# Altium project 5vto3.3v.PrjPCB
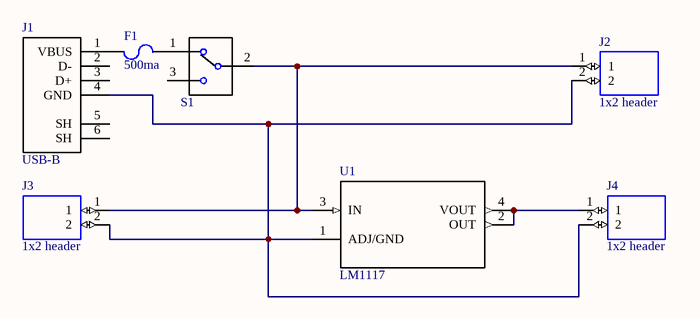
[diagram p0: 5vto3.3v.SchDoc]
1 sheet, 7 parts. Net scope: global (net labels, ports and power ports of the same name join across sheets).
Board file: 5vto3.3v.PcbDoc

## Sheet 5vto3.3v.SchDoc: 5vto3.3v
size A4; Author: Julong Xie; Organization: Altium Limited; Address1: L3, 12a Rodborough Rd; Address2: Frenchs Forest; Address3: NSW; Address4: Australia 2086; Revision: v0.1; SheetNumber: 1; SheetTotal: 1

### Parts
F1  500ma  [Fuse 0603]
J1  USB-B  [SAMTEC_USB-B-S-S-B-VT-R]
J2  1x2 header  [B2B-XH-A(LF)(SN)]
J3  1x2 header  [B2B-XH-A(LF)(SN)]
J4  1x2 header  [B2B-XH-A(LF)(SN)]
S1  TOGGLE SWITCH  [A101SYCQ04]  (value not drawn)
U1  LM1117  [LM1117MP-3.3]

### Nets
NetF1_1: F1.1 S1.1
NetJ1_4: J1.4(GND) J2.2 J3.2 J4.2 U1.1(ADJ/GND)
NetJ2_1: J2.1 J3.1 S1.2 U1.3(IN)
NetJ4_1: J4.1 U1.2(OUT) U1.4(VOUT)

Not connected (* = marked no-connect by the designer): F1 2; J1 1(VBUS) 2(D-) 3(D+) 5(SH) 6(SH); S1 3

### Notes on the sheet
- Title
- Size:
- Date:
- A4
- Number:
- Time:
- Revision:
- Sheet
- of
- Author:
- File:

### Library data of the parts
F1 = 0494.500NRHF: FUSE BOARD MOUNT 500MA 32VAC/VDC; Manufacturer: Littelfuse; Voltage Rating (DC): 32V; Fuse Type: Board Mount (Cartridge Style Excluded); Approvals: CSA,UR; Supplier 1: Digi-Key; Supplier Part Number 1: F5802CT-ND; Manufacturer Part Number: 0494.500NRHF; Stock 1: 0; Mount: Surface Mount; Case Code (Metric): 1608; Case Code (Imperial): 0603; Min Operating Temperature: -55°C; Max Operating Temperature: 90°C; Packaging: Tape and Reel; Current Rating: 500mA; Package Quantity: 5000; Voltage Rating (AC): 32V; Length: 0.063inch; Height: 0.012inch; Width: 0.032inch; ComponentLink1URL: http://www.littelfuse.com/~/media/electronics/datasheets/fuses/littelfuse_fuse_494_datasheet.pdf.pdf; ComponentLink1Description: http://www.littelfuse.com/~/media/electronics/datasheets/fuses/littelfuse_fuse_494_datasheet.pdf.pdf
J1 = 67068-8000: MOLEX         67068-8000            USB, 2.0 TYPE B, RECEPTACLE, THT; Gender: Female; Max Voltage Rating (AC): 30V; Connector Type: Receptacle,USB; Number of Ports: 1; Number of Contacts: 4; Current Rating: 1.5A; Insulation Resistance: 1GR; USB Standard: USB 2.0; Pitch: 2.5mm; Catagory: Connector; Supplier 1: Avnet; Supplier Part Number 1: 0670688000; Manufacturer: Molex; Manufacturer Part Number: 67068-8000; Stock 1: 0; Pricing 1: 1=0.4389, 10=0.4379, 25=0.4369, 50=0.4359, 100=0.4349 (USD); Mount: Through Hole; Contact Material: Bronze; Contact Plating: Gold; Number of Terminals: 4; Housing Material: Nylon; Color: Black; Housing Color: Black; Min Operating Temperature: 0°C; Max Operating Temperature: 50°C; Packaging: Tray; Package Quantity: 1200; Termination: Solder; Orientation: Right Angle; Voltage Rating: 30V; Number of Positions: 4; Number of Circuits: 4; Number of Rows: 2; Length: 12mm; Depth: 17mm; Radiation Hardening: No; REACH SVHC: Unknown; Lead Free: Lead Free; Flammability Rating: UL94 V-0; ComponentLink1URL: http://uk.rs-online.com/webdocs/13c4/0900766b813c46c9.pdf; ComponentLink1Description: http://uk.rs-online.com/webdocs/13c4/0900766b813c46c9.pdf; ComponentLink2URL: http://www.molex.com/webdocs/datasheets/pdf/en-us/0670688000_IO_CONNECTORS.pdf; ComponentLink2Description: http://www.molex.com/webdocs/datasheets/pdf/en-us/0670688000_IO_CONNECTORS.pdf; ComponentLink3URL: https://www.verical.com/server-webapp/html/getDatasheet?partID=152710; ComponentLink3Description: https://www.verical.com/server-webapp/html/getDatasheet?partID=152710; ComponentLink4URL: http://www.farnell.com/datasheets/2051863.pdf; ComponentLink4Description: http://www.farnell.com/datasheets/2051863.pdf; ComponentLink5URL: http://www.mouser.com/ds/2/276/0670688000_IO_CONNECTORS-172066.pdf; ComponentLink5Description: http://www.mouser.com/ds/2/276/0670688000_IO_CONNECTORS-172066.pdf; ComponentLink6URL: http://www.onlinecomponents.com/productFiles/mf-MOL/782280670688000_io_nectors.pdf; ComponentLink6Description: http://www.onlinecomponents.com/productFiles/mf-MOL/782280670688000_io_nectors.pdf
J2-J4 = B2B-XH-A(LF)(SN): HEADER, VERTICAL, 2WAY; Manufacturer: JST; Number of Positions: 2; Connector Type: Male Pin; Contact Resistance: 20mR; Max Current Rating: 3A; Max Voltage Rating (AC): 250V; Insulation Resistance: 1GR; Pitch: 2.5mm; Wire/Cable Gauge: 22AWG; Supplier 1: Digi-Key; Supplier Part Number 1: 455-2247-ND; Manufacturer Part Number: B2B-XH-A(LF)(SN); Stock 1: 404007; Mount: Through Hole; Color: Natural; Contact Material: Brass; Contact Plating: Copper,Lead,Tin; Housing Color: White; Housing Material: Polyamide; Min Operating Temperature: -25°C; Max Operating Temperature: 85°C; Number of Rows: 1; Packaging: Bulk; Termination: Solder; Orientation: Straight; Current Rating: 3A; Voltage Rating (AC): 250V; Fastening Type: Detent; Number of Contacts: 2; Max Voltage Rating (DC): 250V; Voltage Rating: 250V; Length: 7.4mm; Depth: 5.75mm; Lead Pitch: 2.5mm; Lead Free: Lead Free; REACH SVHC: No SVHC; ComponentLink1URL: https://www.verical.com/server-webapp/html/getDatasheet?partID=640357; ComponentLink1Description: https://www.verical.com/server-webapp/html/getDatasheet?partID=640357; ComponentLink2URL: http://www.farnell.com/datasheets/2057209.pdf; ComponentLink2Description: http://www.farnell.com/datasheets/2057209.pdf; ComponentLink3URL: https://www.verical.com/server-webapp/html/getDatasheet?partID=385291; ComponentLink3Description: https://www.verical.com/server-webapp/html/getDatasheet?partID=385291; ComponentLink4URL: http://www.rapidonline.com/pdf/523653.pdf; ComponentLink4Description: http://www.rapidonline.com/pdf/523653.pdf
S1 = A101SYCQ04: Toggle Switches ON-ON SPDT Bat Long; Manufacturer: TE Connectivity; Actuator Material: Phenolic; Voltage Rating (AC): 250V; Current Rating: 5A; Contact Resistance: 10mR; Max Voltage Rating (DC): 28V; Illumination Type: Illuminated; Actuator Length: 10.41mm; Supplier 1: Newark; Supplier Part Number 1: 72R6942; Manufacturer Part Number: A101SYCQ04; Stock 1: 937; Pricing 1: 1=2.78, 10=2.67, 25=2.55, 50=2.36, 100=2.33, 500=2.18, 1000=1.96, 2500=1.92 (USD); Mount: PCB; Contact Material: Copper,Silver; Contact Plating: Silver; Min Operating Temperature: -30°C; Max Operating Temperature: 85°C; Throw Configuration: SPDT; Contact Current Rating: 5A; Package Quantity: 100; Max Voltage Rating (AC): 250V; Termination: Solder; Packaging: Bulk; REACH SVHC: Unknown; Flammability Rating: UL94 V-1; Lead Free: Lead Free; ELV: Compliant; ComponentLink1URL: http://www.farnell.com/datasheets/1491719.pdf; ComponentLink1Description: http://www.farnell.com/datasheets/1491719.pdf; ComponentLink2URL: http://www.farnell.com/datasheets/84591.pdf; ComponentLink2Description: http://www.farnell.com/datasheets/84591.pdf
U1 = LM1117MPX-3.3/NOPB: TEXAS INSTRUMENTS   LM1117MPX-3.3/NOPB.   LINEAR REG, FIX, 3.3V, 800MA, SOT-223-4, FULL REEL; Min Input Voltage: 2.6V; Max Input Voltage: 15V; Dropout Voltage: 1.2V; Number of Outputs: 1; Polarity: Positive; Quiescent Current: 10mA; Accuracy: 1%; Output Type: Fixed; Supplier 1: Arrow; Supplier Part Number 1: LM1117MPX-3.3/NOPB; Manufacturer: Texas Instruments; Manufacturer Part Number: LM1117MPX-3.3/NOPB; Stock 1: 3; Pricing 1: 1=0.4329, 2001=0.3972 (USD); Mount: Surface Mount; Case/Package: SOT-223; Number of Pins: 4; Contact Plating: Matte,Tin; Min Operating Temperature: -40°C; Max Operating Temperature: 125°C; Nominal Output Voltage: 3.3V; Output Current: 800mA; Packaging: Tape and Reel; Output Voltage: 3.3V; Max Output Current: 800mA; Current Rating: 800mA; Output Voltage Accuracy: 1%; Max Output Voltage: 3.3V; Length: 6.5mm; Height: 1.6mm; Width: 3.56mm; REACH SVHC: No SVHC; Lead Free: Lead Free; ComponentLink1URL: http://www.ti.com/general/docs/lit/getliterature.tsp?genericPartNumber=LM1117&&fileType=pdf; ComponentLink1Description: http://www.ti.com/general/docs/lit/getliterature.tsp?genericPartNumber=LM1117&&fileType=pdf; ComponentLink2URL: http://www.farnell.com/datasheets/1772317.pdf; ComponentLink2Description: http://www.farnell.com/datasheets/1772317.pdf